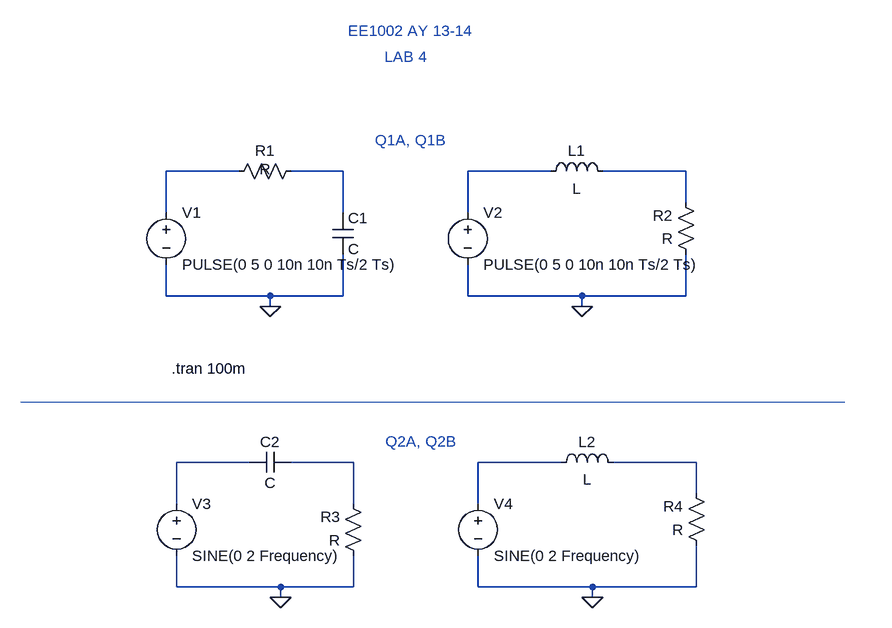
[diagram p0: schematic EE1002_LTSpice_Lab4.asc]
EE1002_LTSpice_Lab4.asc, the LTspice schematic file:
Version 4
SHEET 1 1248 704
WIRE 144 16 32 16
WIRE 304 16 224 16
WIRE 624 16 496 16
WIRE 832 16 704 16
WIRE 832 64 832 16
WIRE 32 80 32 16
WIRE 304 80 304 16
WIRE 496 80 496 16
WIRE 32 208 32 160
WIRE 192 208 32 208
WIRE 304 208 304 144
WIRE 304 208 192 208
WIRE 496 208 496 160
WIRE 672 208 496 208
WIRE 832 208 832 144
WIRE 832 208 672 208
WIRE 192 224 192 208
WIRE 672 224 672 208
WIRE 160 464 48 464
WIRE 320 464 224 464
WIRE 640 464 512 464
WIRE 848 464 720 464
WIRE 848 512 848 464
WIRE 48 528 48 464
WIRE 320 528 320 464
WIRE 512 528 512 464
WIRE 48 656 48 608
WIRE 208 656 48 656
WIRE 320 656 320 608
WIRE 320 656 208 656
WIRE 512 656 512 608
WIRE 688 656 512 656
WIRE 848 656 848 592
WIRE 848 656 688 656
WIRE 208 672 208 656
WIRE 688 672 688 656
FLAG 192 224 0
FLAG 672 224 0
FLAG 208 672 0
FLAG 688 672 0
SYMBOL res 240 0 R90
WINDOW 0 0 56 VBottom 0
WINDOW 3 28 56 VBottom 0
SYMATTR InstName R1
SYMBOL cap 288 80 R0
SYMATTR InstName C1
SYMBOL voltage 32 64 R0
WINDOW 123 0 0 Left 0
WINDOW 39 0 0 Left 0
SYMATTR InstName V1
SYMATTR Value PULSE(0 5 0 10n 10n Ts/2 Ts)
SYMBOL res 848 160 R180
WINDOW 0 36 76 Left 0
WINDOW 3 36 40 Left 0
SYMATTR InstName R2
SYMBOL ind 608 32 R270
WINDOW 0 32 56 VTop 0
WINDOW 3 5 56 VBottom 0
SYMATTR InstName L1
SYMBOL voltage 496 64 R0
WINDOW 123 0 0 Left 0
WINDOW 39 0 0 Left 0
SYMATTR InstName V2
SYMATTR Value PULSE(0 5 0 10n 10n Ts/2 Ts)
SYMBOL res 336 624 R180
WINDOW 0 36 76 Left 0
WINDOW 3 36 40 Left 0
SYMATTR InstName R3
SYMBOL cap 224 448 R90
WINDOW 0 0 32 VBottom 0
WINDOW 3 32 32 VTop 0
SYMATTR InstName C2
SYMBOL voltage 48 512 R0
WINDOW 123 0 0 Left 0
WINDOW 39 0 0 Left 0
SYMATTR InstName V3
SYMATTR Value SINE(0 2 Frequency)
SYMBOL res 864 608 R180
WINDOW 0 36 76 Left 0
WINDOW 3 36 40 Left 0
SYMATTR InstName R4
SYMBOL ind 624 480 R270
WINDOW 0 32 56 VTop 0
WINDOW 3 5 56 VBottom 0
SYMATTR InstName L2
SYMBOL voltage 512 512 R0
WINDOW 123 0 0 Left 0
WINDOW 39 0 0 Left 0
SYMATTR InstName V4
SYMATTR Value SINE(0 2 Frequency)
TEXT 40 320 Left 0 !.tran 100m
TEXT 408 -32 Center 0 ;Q1A, Q1B
TEXT 424 432 Center 0 ;Q2A, Q2B
TEXT -192 360 Left 0 ;_________________________________________________________________________________________________
TEXT 312 -200 Left 0 ;EE1002 AY 13-14
TEXT 368 -160 Left 0 ;LAB 4

The netlist it stands for:
* EE1002_LTSpice_Lab4.asc
R1 N002 N001 R
C1 N002 0 C
V1 N001 0 PULSE(0 5 0 10n 10n Ts/2 Ts)
R2 0 N004 R
L1 N003 N004 L
V2 N003 0 PULSE(0 5 0 10n 10n Ts/2 Ts)
R3 0 N006 R
C2 N006 N005 C
V3 N005 0 SINE(0 2 Frequency)
R4 0 N008 R
L2 N007 N008 L
V4 N007 0 SINE(0 2 Frequency)
.tran 100m
* Q1A, Q1B
* Q2A, Q2B
* _________________________________________________________________________________________________
* EE1002 AY 13-14
* LAB 4
.backanno
.end